# Altium schematic sheet Analog_Inputs.SchDoc
size A4
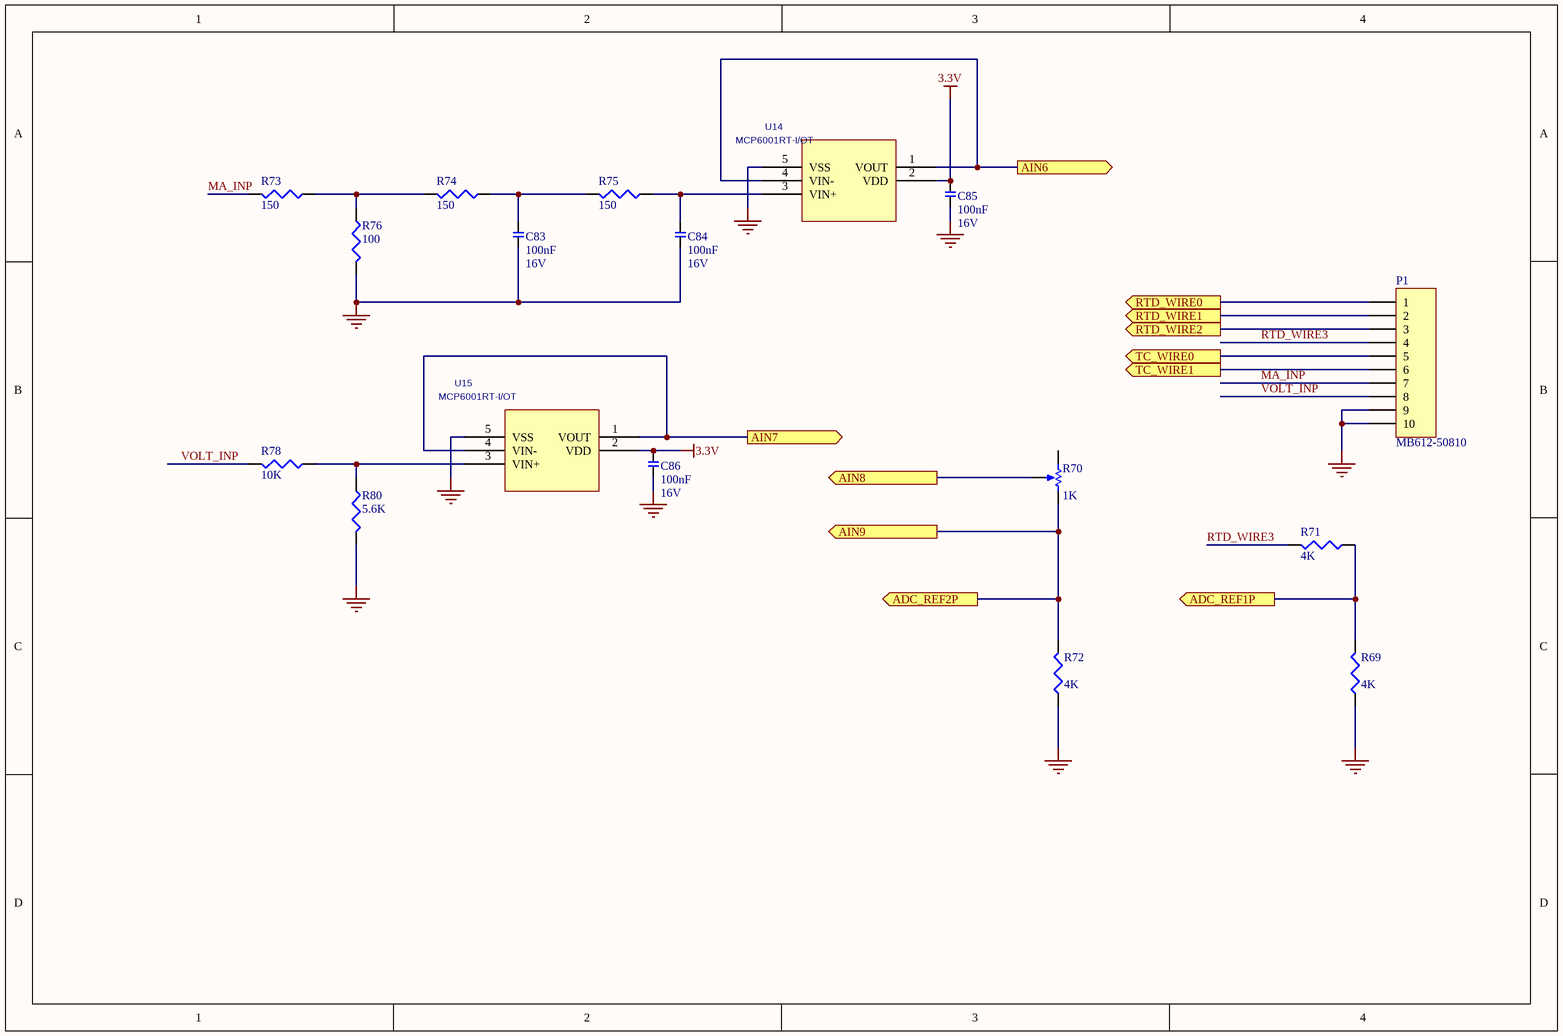
[diagram p0: Analog_Inputs.SchDoc]

## Parts
C83  Rating: 16V  [T_CAPC0603X33N]  (hidden comment: 100nF)
C84  Rating: 16V  [T_CAPC0603X33N]  (hidden comment: 100nF)
C85  Rating: 16V  [T_CAPC0603X33N]  (hidden comment: 100nF)
C86  Rating: 16V  [T_CAPC0603X33N]  (hidden comment: 100nF)
P1  MB612-50810  [1729186 5.08 - 10pos]
R69  value 4K  [J1-0603]  (hidden comment: Res3)
R70  value 1K  [VR5]  (hidden comment: RPot)
R71  value 4K  [J1-0603]  (hidden comment: Res3)
R72  value 4K  [J1-0603]  (hidden comment: Res3)
R73  value 150  [J1-0603]  (hidden comment: Res3)
R74  value 150  [J1-0603]  (hidden comment: Res3)
R75  value 150  [J1-0603]  (hidden comment: Res3)
R76  value 100  [J1-0603]  (hidden comment: Res3)
R78  value 10K  [J1-0603]  (hidden comment: Res3)
R80  value 5.6K  [J1-0603]  (hidden comment: Res3)
U14  MCP6001RT-I/OT  [SOT-23-5]
U15  MCP6001RT-I/OT  [SOT-23-5]

## Ports
ADC_REF1P (out), ADC_REF2P (out), AIN6 (out), AIN7 (out), AIN8 (out), AIN9 (out), RTD_WIRE0 (out), RTD_WIRE1 (out), RTD_WIRE2 (out), TC_WIRE0 (out), TC_WIRE1 (out)

## Nets
3.3V: C85.2 C86.2 U14.2(VDD) U15.2(VDD)
GND: C83.1 C84.1 C85.1 C86.1 P1.9 P1.10 R69.1 R72.1 R76.2 R80.2 U14.5(VSS) U15.5(VSS)
ADC_REF1P: R69.2 R71.1 ; port ADC_REF1P
ADC_REF2P: R70.2(BOT) R72.2 ; port ADC_REF2P, port AIN9
AIN6: U14.1(VOUT) U14.4(VIN-) ; port AIN6
AIN7: U15.1(VOUT) U15.4(VIN-) ; port AIN7
AIN8: R70.3(TAP) ; port AIN8
MA_INP: P1.7 R73.2
RTD_WIRE0: P1.1 ; port RTD_WIRE0
RTD_WIRE1: P1.2 ; port RTD_WIRE1
RTD_WIRE2: P1.3 ; port RTD_WIRE2
RTD_WIRE3: P1.4 R71.2
TC_WIRE0: P1.5 ; port TC_WIRE0
TC_WIRE1: P1.6 ; port TC_WIRE1
VOLT_INP: P1.8 R78.2
NetC83_2: C83.2 R74.1 R75.2
NetC84_2: C84.2 R75.1 U14.3(VIN+)
NetR73_1: R73.1 R74.2 R76.1
NetR78_1: R78.1 R80.1 U15.3(VIN+)

Not connected (* = marked no-connect by the designer): R70 1(TOP)

## Library data of the parts
C83-C86 = C-X7R-100nF-16V-10%-0603: Capacitor Ceramic X7R 100nF 16V 10% 0603; Tolerance: 10%; Type: X7R; Value: 100nF
P1 = Header 10: Header, 10-Pin; LatestRevisionDate: 17-Jul-2002; LatestRevisionNote: Re-released for DXP Platform.; Publisher: Altium Limited
R69 R71-R76 R78 R80 = Res3: Resistor; Published: 8-Jun-2000; LatestRevisionDate: 29-May-2009; LatestRevisionNote: IPC-7351 Footprint Added.; PackageReference: J1-0603; Publisher: Altium Limited; PackageDescription: Chip Resistor
R70 = RPot: Potentiometer; Sim Note: Enter the Resistance value and the set point into parameter fields.; Set Position: 0.5; Published: 8-Jun-2000; LatestRevisionDate: 17-Jul-2002; LatestRevisionNote: Re-released for DXP Platform.; PackageReference: VR5; Publisher: Altium Limited; PackageDescription: Variable Resistor, Thru-Hole; 3 Leads
U14 U15 = MCP6001RT-I/OT: C: Copyright (C) 2015 Accelerated Designs. All rights reserved; Vendor: Microchip; Built_By: EMA_UL_Team; SourceLibrary: Microchip_2011-05-13; Value: mcp6001rt-i/ot; Manufacturer_Part_Number: mcp6001rt-i/ot